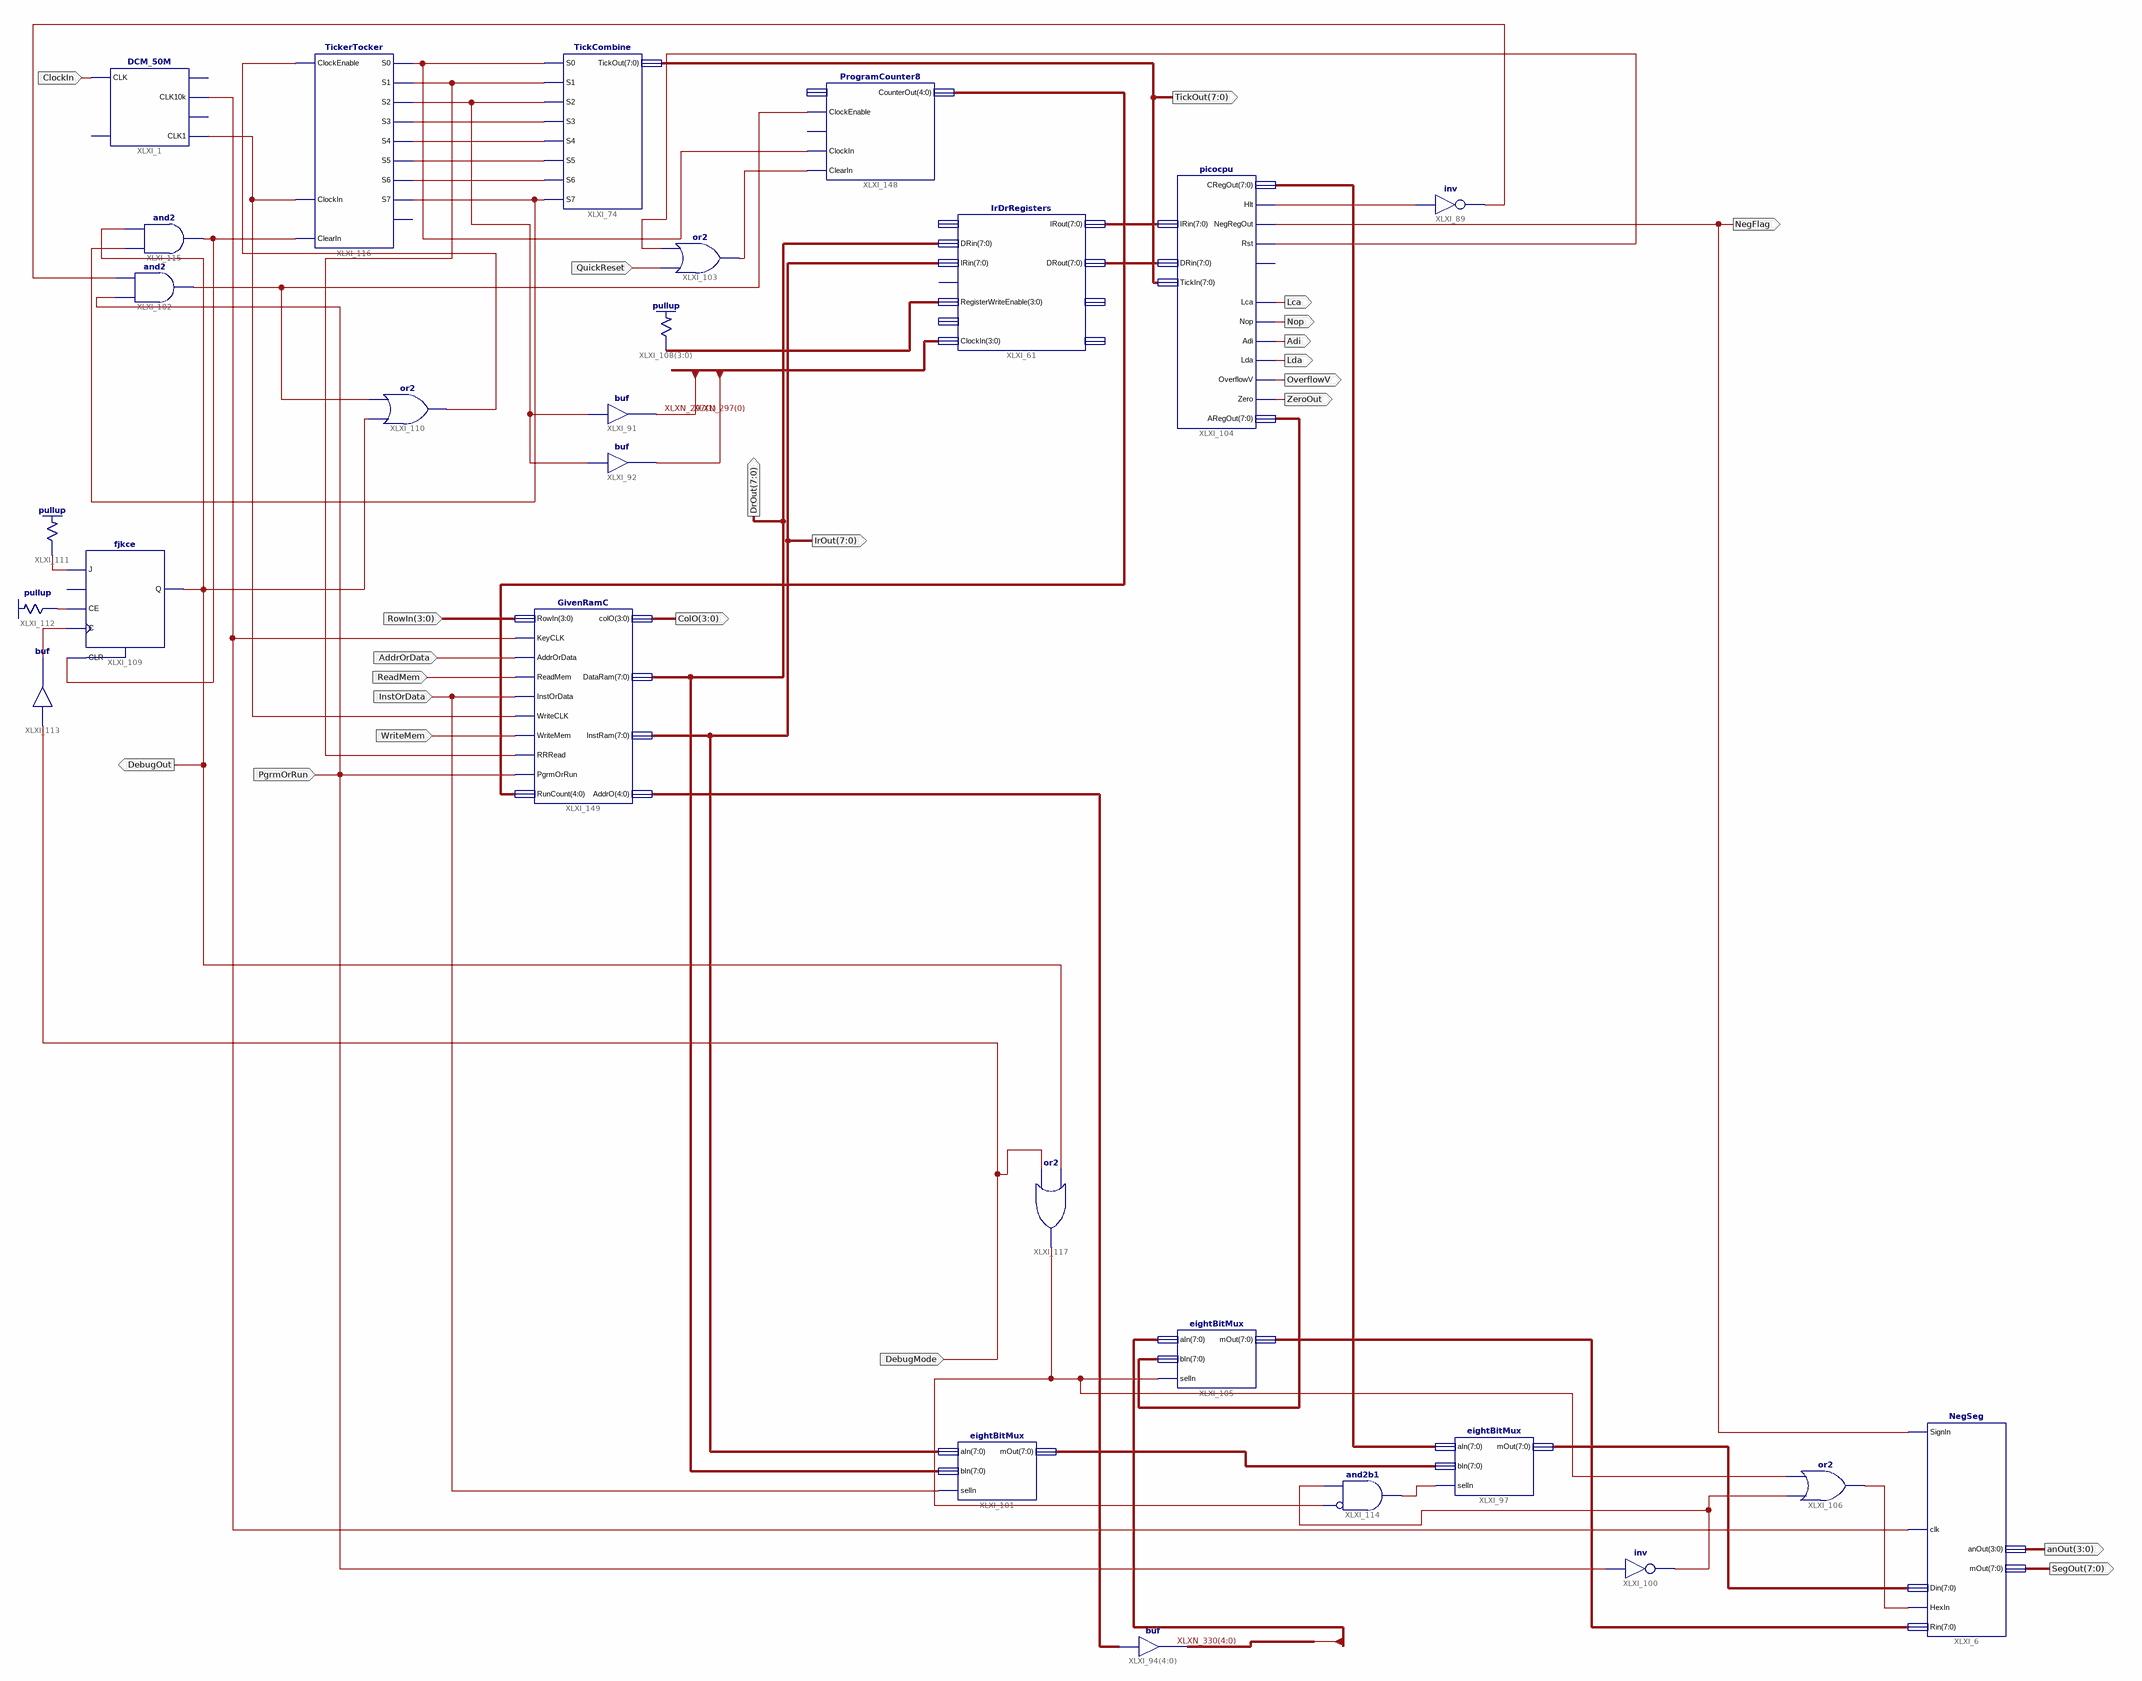
[diagram p0: schematic sheet 1]
// Xilinx ISE schematic GivenRam.sch (spartan3e) as structural Verilog: 28 symbols, 23 ports
module GivenRam (
  input  ClockIn,
  input  [3:0] RowIn,
  input  InstOrData,
  input  PgrmOrRun,
  input  QuickReset,
  input  DebugMode,
  input  AddrOrData,
  input  WriteMem,
  input  ReadMem,
  output [3:0] anOut,
  output [7:0] SegOut,
  output NegFlag,
  output [7:0] TickOut,
  output Lca,
  output Nop,
  output Adi,
  output [3:0] ColO,
  output [7:0] DrOut,
  output Lda,
  output OverflowV,
  output ZeroOut,
  output [7:0] IrOut,
  output DebugOut
);

  wire HexLoadModeIn, XLXN_80, XLXN_81, XLXN_275, XLXN_276, XLXN_277, XLXN_278, XLXN_279, XLXN_294, XLXN_299,
       XLXN_311, XLXN_344, XLXN_347, XLXN_348, XLXN_361, XLXN_364, XLXN_368, XLXN_369, XLXN_385, XLXN_386,
       XLXN_388, XLXN_389, XLXN_477, XLXN_478;
  wire [3:0] XLXN_296, XLXN_297;
  wire [4:0] ProgramCounterOut, XLXN_333;
  wire [7:0] XLXN_82, XLXN_214, XLXN_215, XLXN_330, XLXN_331, XLXN_342, XLXN_351, XLXN_352;

  DCM_50M XLXI_1 (.CLK(ClockIn), .CLK10k(XLXN_81), .CLK1(XLXN_80));  // open: RST, CLK1M, CLK1k
  NegSeg XLXI_6 (
    .SignIn(NegFlag), .clk(XLXN_81), .Din(XLXN_331), .anOut(anOut), .mOut(SegOut), .HexIn(XLXN_368),
    .Rin(XLXN_352));
  IrDrRegisters XLXI_61 (
    .DRin(DrOut), .IRin(IrOut), .RegisterWriteEnable(XLXN_296), .ClockIn(XLXN_297), .IRout(XLXN_214),
    .DRout(XLXN_215));  // open: Statusin, ClrIn, Din, Statusout, Dout
  not XLXI_89 (XLXN_344, XLXN_294);
  TickCombine XLXI_74 (
    .S0(XLXN_299), .S1(XLXN_311), .S2(XLXN_275), .S3(XLXN_276), .S4(XLXN_277), .S5(XLXN_278), .S6(XLXN_279),
    .S7(XLXN_385), .TickOut(TickOut));
  buf XLXI_91 (XLXN_297[1], XLXN_275);
  buf XLXI_92 (XLXN_297[0], XLXN_275);
  assign XLXN_330[4:0] = XLXN_333;  // buf XLXI_94[4..0], 5 bits wide
  not XLXI_100 (HexLoadModeIn, PgrmOrRun);
  eightBitMux XLXI_101 (.aIn(IrOut), .bIn(DrOut), .selIn(InstOrData), .mOut(XLXN_342));
  eightBitMux XLXI_97 (.aIn(XLXN_82), .bIn(XLXN_342), .selIn(XLXN_369), .mOut(XLXN_331));
  and XLXI_102 (XLXN_477, PgrmOrRun, XLXN_344);
  or XLXI_103 (XLXN_478, QuickReset, XLXN_348);
  picocpu XLXI_104 (
    .IRin(XLXN_214), .DRin(XLXN_215), .TickIn(TickOut), .CRegOut(XLXN_82), .Hlt(XLXN_294), .Lca(Lca),
    .NegRegOut(NegFlag), .Rst(XLXN_348), .Nop(Nop), .Adi(Adi), .Lda(Lda), .OverflowV(OverflowV),
    .Zero(ZeroOut), .ARegOut(XLXN_351));  // open: Mvi
  eightBitMux XLXI_105 (.aIn(XLXN_330), .bIn(XLXN_351), .selIn(XLXN_389), .mOut(XLXN_352));
  or XLXI_106 (XLXN_368, HexLoadModeIn, XLXN_389);
  \pullup  XLXI_108[3:0] (.O(XLXN_296));
  or XLXI_110 (XLXN_347, DebugOut, XLXN_477);
  and XLXI_114 (XLXN_369, ~XLXN_389, HexLoadModeIn);  // and2b1
  fjkce XLXI_109 (.C(XLXN_386), .CE(XLXN_364), .CLR(XLXN_388), .J(XLXN_361), .Q(DebugOut));  // open: K
  \pullup  XLXI_111 (.O(XLXN_361));
  \pullup  XLXI_112 (.O(XLXN_364));
  buf XLXI_113 (XLXN_386, DebugMode);
  and XLXI_115 (XLXN_388, XLXN_385, DebugOut);
  TickerTocker XLXI_116 (
    .ClockEnable(XLXN_347), .ClockIn(XLXN_80), .S0(XLXN_299), .S1(XLXN_311), .S2(XLXN_275), .S3(XLXN_276),
    .S4(XLXN_277), .S5(XLXN_278), .S6(XLXN_279), .S7(XLXN_385), .ClearIn(XLXN_388));  // open: TickOut
  or XLXI_117 (XLXN_389, DebugMode, DebugOut);
  ProgramCounter8 XLXI_148 (
    .ClockEnable(XLXN_477), .ClockIn(XLXN_299), .ClearIn(XLXN_478), .CounterOut(ProgramCounterOut));  // open: CountLoad, PushLoad
  GivenRamC XLXI_149 (
    .RowIn(RowIn), .KeyCLK(XLXN_81), .AddrOrData(AddrOrData), .ReadMem(ReadMem), .InstOrData(InstOrData),
    .WriteCLK(XLXN_80), .WriteMem(WriteMem), .RRRead(XLXN_311), .PgrmOrRun(PgrmOrRun),
    .RunCount(ProgramCounterOut), .colO(ColO), .DataRam(DrOut), .InstRam(IrOut), .AddrO(XLXN_333));
endmodule
